# Altium schematic sheet ZYNQ_FLASH.SchDoc
size 431 x 279 mm
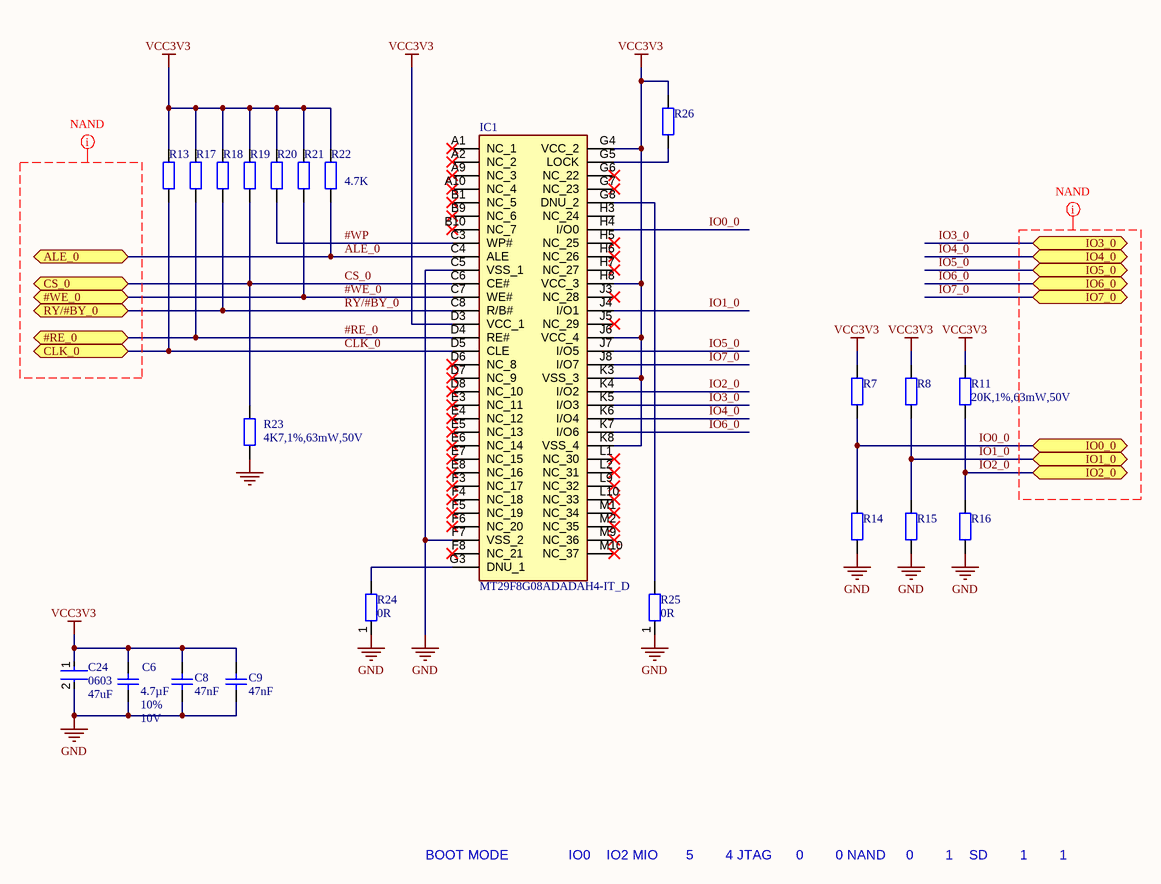
[diagram p0: ZYNQ_FLASH.SchDoc]

## Parts
C6  Tolerance: 10%  Voltage Rating: 10V  [CAP0402i]  (hidden comment: 4.7µF)
C8  Capacitance: 47nF  [CAP0201i]
C9  Capacitance: 47nF  [CAP0201i]
C24  Case Code (Imperial): 0603  Capacitance: 47uF  [FP-GRM188-0_2-IPC_B]  (hidden comment: GRM188R60J476ME15D)
IC1  MT29F8G08ADADAH4-IT_D  [BGA63C80P10X12_900X1100X100]
R7  20kOhm  [RES0402i]  (value not drawn)
R8  20kOhm  [RES0402i]  (value not drawn)
R11  value 20K,1%,63mW,50V  [RES0402i]  (hidden comment: 20kOhm)
R13  4.7K  [RES0402i]  (value not drawn)
R14  20kOhm  [RES0402i]  (value not drawn)
R15  20kOhm  [RES0402i]  (value not drawn)
R16  20kOhm  [RES0402i]  (value not drawn)
R17  4.7K  [RES0402i]  (value not drawn)
R18  4.7K  [RES0402i]  (value not drawn)
R19  4.7K  [RES0402i]  (value not drawn)
R20  4.7K  [RES0402i]  (value not drawn)
R21  4.7K  [RES0402i]  (value not drawn)
R22  4.7K  [RES0402i]
R23  value 4K7,1%,63mW,50V  [RES0402i]  (hidden comment: 4.7K)
R24  value 0R  [RES0402i]  (hidden comment: 0 Ohms)
R25  value 0R  [RES0402i]  (hidden comment: 0 Ohms)
R26  20kOhm  [RES0402i]  (value not drawn)

## Ports
#RE_0 (bidir), #WE_0 (bidir), ALE_0 (bidir), CLK_0 (bidir), CS_0 (bidir), IO0_0 (bidir), IO1_0 (bidir), IO2_0 (bidir), IO3_0 (bidir), IO4_0 (bidir), IO5_0 (bidir), IO6_0 (bidir), IO7_0 (bidir), RY/#BY_0 (bidir)

## Nets
GND: C6.1 C8.1 C9.1 C24.2 IC1.C5(VSS_1) IC1.F7(VSS_2) R14.1 R15.1 R16.1 R23.1 R24.1 R25.1
VCC3V3: C6.2 C8.2 C9.2 C24.1 IC1.D3(VCC_1) IC1.G4(VCC_2) IC1.H8(VCC_3) IC1.J6(VCC_4) IC1.K3(VSS_3) IC1.K8(VSS_4) R7.2 R8.2 R11.2 R13.2 R17.2 R18.2 R19.2 R20.2 R21.2 R22.2 R26.2
#RE_0: IC1.D4(RE#) R17.1 ; port #RE_0
#WE_0: IC1.C7(WE#) R21.1 ; port #WE_0
#WP: IC1.C3(WP#) R20.1
ALE_0: IC1.C4(ALE) R22.1 ; port ALE_0
CLK_0: IC1.D5(CLE) R13.1 ; port CLK_0
CS_0: IC1.C6(CE#) R19.1 R23.2 ; port CS_0
IO0_0: IC1.H4(I/O0) R7.1 R14.2 ; port IO0_0
IO1_0: IC1.J4(I/O1) R8.1 R15.2 ; port IO1_0
IO2_0: IC1.K4(I/O2) R11.1 R16.2 ; port IO2_0
IO3_0: IC1.K5(I/O3) ; port IO3_0
IO4_0: IC1.K6(I/O4) ; port IO4_0
IO5_0: IC1.J7(I/O5) ; port IO5_0
IO6_0: IC1.K7(I/O6) ; port IO6_0
IO7_0: IC1.J8(I/O7) ; port IO7_0
RY/#BY_0: IC1.C8(R/B#) R18.1 ; port RY/#BY_0
NetIC1_G3: IC1.G3(DNU_1) R24.2
NetIC1_G5: IC1.G5(LOCK) R26.1
NetIC1_G8: IC1.G8(DNU_2) R25.2

Not connected (* = marked no-connect by the designer): IC1 A1(NC_1)* A2(NC_2)* A9(NC_3)* A10(NC_4)* B1(NC_5)* B9(NC_6)* B10(NC_7)* D6(NC_8)* D7(NC_9)* D8(NC_10)* E3(NC_11)* E4(NC_12)* E5(NC_13)* E6(NC_14)* E7(NC_15)* E8(NC_16)* F3(NC_17)* F4(NC_18)* F5(NC_19)* F6(NC_20)* F8(NC_21)* G6(NC_22)* G7(NC_23)* H3(NC_24) H5(NC_25)* H6(NC_26)* H7(NC_27)* J3(NC_28)* J5(NC_29)* L1(NC_30)* L2(NC_31)* L9(NC_32)* L10(NC_33)* M1(NC_34)* M2(NC_35)* M9(NC_36)* M10(NC_37)*

## Layout directives
net class NAND: (no net found under the mark)

## Notes on the sheet
- BOOT MODE
  IO0    IO2
  MIO       5        4
  JTAG      0        0
  NAND     0        1
  SD        1        1
- DWG. NO.
- REV.
- SHT.
- THIS DOCUMENT AND THE DATA DISCLOSED HEREIN OR HEREWITH IS THE PROPERTY OF ALTIUM LIMITED AND MAY BE FREELY DISTRIBUTED IN WHOLE. NO RIGHTS ARE RESERVED OR EXPRESS OR IMPLIED WARANTEE GIVEN.
- REVISION
- DESCRIPTION
- DATE
- APPROVED
- ENG:
- APPROVALS
- PROJECT
- DSN:
- CHK:
- REFERENCE DOCUMENTS
- PROJECT REVISION:
- TITLE
- DOCUMENT REVISION:
- DESIGN ITEM:
- BOM:
- FAB DWG:
- PCB DWG:
- ASSY DWG:
- SCALE:
- SIZE
- B
- CAGE CODE
- FILE NAME
- DWG NO.
- SHEET
- OF
- REV

## Library data of the parts
C6 = Cap_4.7uF_10V_10%_0402: CAP CER 4.7UF 10V X5R 0402; Part Number: C1005X5R1A475K050BC; Manufacturer 1: TDK; Dielectric Material: Ceramic; Value: 4.7µF, 10V, X5R; Supplier 1: Mouser; Manufacturer Part Number 1: C1005X5R1A475K050BC; RoHS: Yes; Category: Ceramic Capacitors; Stock 1: 1272492; Mount: Surface Mount; Case/Package: 0402; Case Code (Metric): 1005; Case Code (Imperial): 0402; Min Operating Temperature: -55°C; Max Operating Temperature: 85°C; Package Quantity: 10000; Packaging: Cut Tape; Voltage Rating (DC): 10V; Series: C; Dielectric: X5R; Length: 0.039inch; Width: 0.02inch; Thickness: 0.022inch; Lead Free: Lead Free; RoHS Compliant: Yes; Reach SVHC Compliant: Yes; ComponentLink1URL: https://datasheet.ciiva.com/14895/tdkmlcccaprange-14895671.pdf?src-supplier=Digi-Key; ComponentLink1Description: https://datasheet.ciiva.com/14895/tdkmlcccaprange-14895671.pdf?src-supplier=Digi-Key; ComponentLink2URL: https://datasheet.ciiva.com/14895/tdkmlcccaprange-14895670.pdf?src-supplier=Digi-Key; ComponentLink2Description: https://datasheet.ciiva.com/14895/tdkmlcccaprange-14895670.pdf?src-supplier=Digi-Key; ComponentLink3URL: https://datasheet.ciiva.com/14895/tdkmlcccaprange-14895672.pdf?src-supplier=Digi-Key; ComponentLink3Description: https://datasheet.ciiva.com/14895/tdkmlcccaprange-14895672.pdf?src-supplier=Digi-Key; Supplier Part Number 1: 810-C1005X5R1A475KBC; Component Type: Generic; Capacitance: 4.7µF
C8 C9 = Cap_47nF_X7R_0201: 0201, 47nF, 10%, 25V, X7R; Value: 47nF, 0201 X7R; Mounting Type: SMT; Package: 0201; Applications: Automotive; Ratings: AEC-Q200; Component Type: Generic; Note: *; Supplier 1: Arrow Electronics; Supplier 2: Future Electronics; Supplier 3: Farnell; Supplier 4: Mouser; Supplier 5: Digikey; Supplier 6: Newark; Supplier Part Number 1: GRM033R61A473KE84D; Supplier Part Number 2: 4125905; Supplier Part Number 3: 3340765; Supplier Part Number 4: 81-GRM033R61A473KE4D; Supplier Part Number 5: 490-14570-1-ND; Supplier Part Number 6: 77AH4496
C24 = CMP-2000-05444-2: Chip Multilayer Ceramic Capacitors for General Purpose, 0603, 47uF, X5R, 15%, 20%, 6.3V; Voltage Rating (DC): 6.3V; Thickness: 0.039inch; Packaging: Tape and Reel; Width: 0.031inch; Dielectric: X5R; Max Operating Temperature: 85°C; Mount: Surface Mount; Case Code (Metric): 1608; Length: 0.063inch; Voltage Rating: 6.3V; Tolerance: 20%; Case/Package: 0603; Min Operating Temperature: -55°C
IC1 = MT29F8G08ADADAH4-IT_D: IC FLASH NAND 8GB 63VFBGA; Manufacturer_Name: Micron; Manufacturer_Part_Number: MT29F8G08ADADAH4-IT:D; Manufacturer: Micron Technology; Memory Format: FLASH,NAND,SLC NAND; Interface: Parallel; Memory Size: 1000000000B; Address Bus Width: 1b; Operating Supply Voltage: 3.3V; Min Supply Voltage: 2.7V; Max Supply Voltage: 3.6V; Word Size: 8b; Page Size: 2KB; Sync/Async: Asynchronous; Access Time-Max: 25ns; Supply Current: 35mA; Datasheet Link: https://www.mouser.co.uk/datasheet/2/671/micron_technology_micts06228-1-1759217.pdf; Height: 1mm; Mouser Part Number: 340-112428-TRAY; Mouser Price/Stock: https://www.mouser.co.uk/ProductDetail/Micron/MT29F8G08ADADAH4-ITD?qs=rrS6PyfT74eZPKUjEpJhBg%3D%3D; Arrow Part Number: MT29F8G08ADADAH4-IT:D; Arrow Price/Stock: https://www.arrow.com/en/products/mt29f8g08adadah4-itd/micron-technology; Supplier 1: Mouser; Supplier Part Number 1: 340-112428-TRAY; Manufacturer Part Number: MT29F8G08ADADAH4-IT:D; RoHS: Yes; Category: Flash; Stock 1: 2500; Pricing 1: 1=13.1, 10=12.13, 50=10.38, 100=9.87, 1000=9.77, 10000=9.77 (USD); Mounting Technology: Surface Mount; Case/Package: VFBGA; Pins: 63; Min Operating Temperature: -40°C; Max Operating Temperature: 85°C; Packaging: Bulk; Series: -; Package Quantity: 1000; Density: 8Gb; Radiation Hardening: No; Lead Free: Lead Free; RoHS Compliant: Yes; ComponentLink1URL: http://components.arrow.com/part/dataview/50637507S8848452N2596?src-supplier=Arrow+Electronics; ComponentLink1Description: http://components.arrow.com/part/dataview/50637507S8848452N2596?src-supplier=Arrow+Electronics; ComponentLink2URL: https://www.verical.com/server-webapp/html/getDatasheet?partID=338141&src-supplier=Verical; ComponentLink2Description: https://www.verical.com/server-webapp/html/getDatasheet?partID=338141&src-supplier=Verical
R7 R8 R11 R14-R16 R26 = Res_20k_1%_0402: 0402,20K,1%,63mW,50V; Part Number: RC0402FR-0720KL; Manufacturer 1: YAGEO; Temperature Coefficient: 100 PPM / C; Voltage: 50V; Tolerance: ±1%; Operating Temperature: -55°C ~ 125°C; Package: 0402 (1005 Metric); Component Type: Generic; Resistance: 20kOhm; Note: *; Alternative Part Number: *; Manufacturer 2: *; Manufacturer Part Number 2: *; Mounting Type: SMT; Manufacturer Part Number 1: RC0402FR-0720KL; Supplier 1: Digi-Key; Supplier 2: Mouser; Supplier 3: Farnell; Supplier Part Number 1: 311-20.0KLRCT-ND; Supplier Part Number 2: 603-RC0402FR-0720KL; Supplier Part Number 3: 3495551
  R7 R8 R14-R16 R26: Value: 20K,1%,63mW,50V
R13 R17-R22 = Res_4K7_1%_0402: 0402,4.7K,1%,63mW,50V; Part Number: AC0402FR-074K7L; Manufacturer 1: YAGEO; Alternative Part Number: CR0402-FX-4701GLF; Temperature Coefficient: 100 PPM / C; Value: 4K7,1%,63mW,50V; Voltage: 50V; Tolerance: ±1%; Operating Temperature: -55°C ~ 125°C; Package: 0402 (1005 Metric); Component Type: Generic; Resistance: 4.7K; Note: *; Manufacturer 2: Bourns; Manufacturer Part Number 2: CR0402-FX-4701GLF; Mounting Type: SMT; Manufacturer Part Number 1: AC0402FR-074K7L; Supplier 1: Mouser; Supplier 2: Digi-Key; Supplier 3: Farnell; Supplier 4: Mouser; Supplier 5: Digi-Key; Supplier 6: Farnell; Supplier Part Number 1: 603-AC0402FR-074K7L; Supplier Part Number 2: YAG3497CT-ND; Supplier Part Number 3: 3495205; Supplier Part Number 4: 652-CR0402FX-4701GLF; Supplier Part Number 6: 4014423; Supplier Part Number 5: CR0402-FX-4701GLFCT-ND
R23 = Res_4K7_1%_0402: 0402,4.7K,1%,63mW,50V; Part Number: AC0402FR-074K7L; Manufacturer 1: YAGEO; Alternative Part Number: CR0402-FX-4701GLF; Temperature Coefficient: 100 PPM / C; Voltage: 50V; Tolerance: ±1%; Operating Temperature: -55°C ~ 125°C; Package: 0402 (1005 Metric); Component Type: Generic; Resistance: 4.7K; Note: *; Manufacturer 2: Bourns; Manufacturer Part Number 2: CR0402-FX-4701GLF; Mounting Type: SMT; Manufacturer Part Number 1: AC0402FR-074K7L; Supplier 1: Mouser; Supplier 2: Digi-Key; Supplier 3: Farnell; Supplier 4: Mouser; Supplier 5: Digi-Key; Supplier 6: Farnell; Supplier Part Number 1: 603-AC0402FR-074K7L; Supplier Part Number 2: YAG3497CT-ND; Supplier Part Number 3: 3495205; Supplier Part Number 4: 652-CR0402FX-4701GLF; Supplier Part Number 6: 4014423; Supplier Part Number 5: CR0402-FX-4701GLFCT-ND
R24 R25 = Res_0R_0402: 0402, 0R; Part Number: CRCW04020000Z0EDC; Manufacturer 1: Vishay; Voltage: 50V; Temperature Coefficient: 0 PPM / C; Operating Temperature: -55°C ~ 125°C; Mounting Type: SMT; Package: 0402 (1005 Metric); Applications: Commercial Grade; Supplier 1: Mouser; Supplier Part Number 1: 71-CRCW04020000Z0EDC; Manufacturer Part Number 1: CRCW04020000Z0EDC; Component Type: Generic; Resistance: 0 Ohms; Note: *; Supplier 2: DigiKey; Supplier 3: Farnell; Supplier Part Number 2: 541-4062-1-ND; Supplier Part Number 3: *